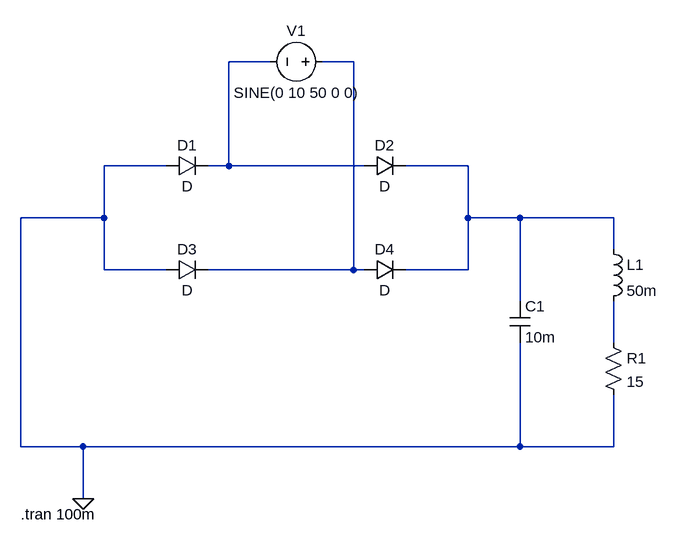
[diagram p0: schematic rectifier=circuit.asc]
rectifier=circuit.asc, the LTspice schematic file:
Version 4.1
SHEET 1 904 680
WIRE 288 -208 224 -208
WIRE 416 -208 368 -208
WIRE 128 -48 32 -48
WIRE 224 -48 224 -208
WIRE 224 -48 192 -48
WIRE 432 -48 224 -48
WIRE 592 -48 496 -48
WIRE 32 32 32 -48
WIRE 32 32 -96 32
WIRE 592 32 592 -48
WIRE 672 32 592 32
WIRE 816 32 672 32
WIRE 816 80 816 32
WIRE 32 112 32 32
WIRE 128 112 32 112
WIRE 416 112 416 -208
WIRE 416 112 192 112
WIRE 432 112 416 112
WIRE 592 112 592 32
WIRE 592 112 496 112
WIRE 672 160 672 32
WIRE 816 224 816 160
WIRE -96 384 -96 32
WIRE 0 384 -96 384
WIRE 672 384 672 224
WIRE 672 384 0 384
WIRE 816 384 816 304
WIRE 816 384 672 384
WIRE 0 464 0 384
FLAG 0 464 0
SYMBOL voltage 384 -208 R90
WINDOW 0 -32 56 VBottom 2
WINDOW 3 32 56 VTop 2
WINDOW 123 0 0 Left 0
WINDOW 39 0 0 Left 0
SYMATTR InstName V1
SYMATTR Value SINE(0 10 50 0 0)
SYMBOL diode 128 -32 R270
WINDOW 0 32 32 VTop 2
WINDOW 3 0 32 VBottom 2
SYMATTR InstName D1
SYMBOL diode 432 -32 R270
WINDOW 0 32 32 VTop 2
WINDOW 3 0 32 VBottom 2
SYMATTR InstName D2
SYMBOL diode 128 128 R270
WINDOW 0 32 32 VTop 2
WINDOW 3 0 32 VBottom 2
SYMATTR InstName D3
SYMBOL diode 432 128 R270
WINDOW 0 32 32 VTop 2
WINDOW 3 0 32 VBottom 2
SYMATTR InstName D4
SYMBOL cap 656 160 R0
SYMATTR InstName C1
SYMATTR Value 10m
SYMBOL ind 800 64 R0
SYMATTR InstName L1
SYMATTR Value 50m
SYMBOL res 800 208 R0
SYMATTR InstName R1
SYMATTR Value 15
TEXT -96 488 Left 2 !.tran 100m

The netlist it stands for:
* rectifier=circuit.asc
V1 N002 N001 SINE(0 10 50 0 0)
D1 0 N001 D
D2 N001 N003 D
D3 0 N002 D
D4 N002 N003 D
C1 N003 0 10m
L1 N003 N004 50m
R1 N004 0 15
.model D D
.lib standard.dio
.tran 100m
.backanno
.end